# EAGLE schematic powersupply_example (EAGLE 7.4.0)
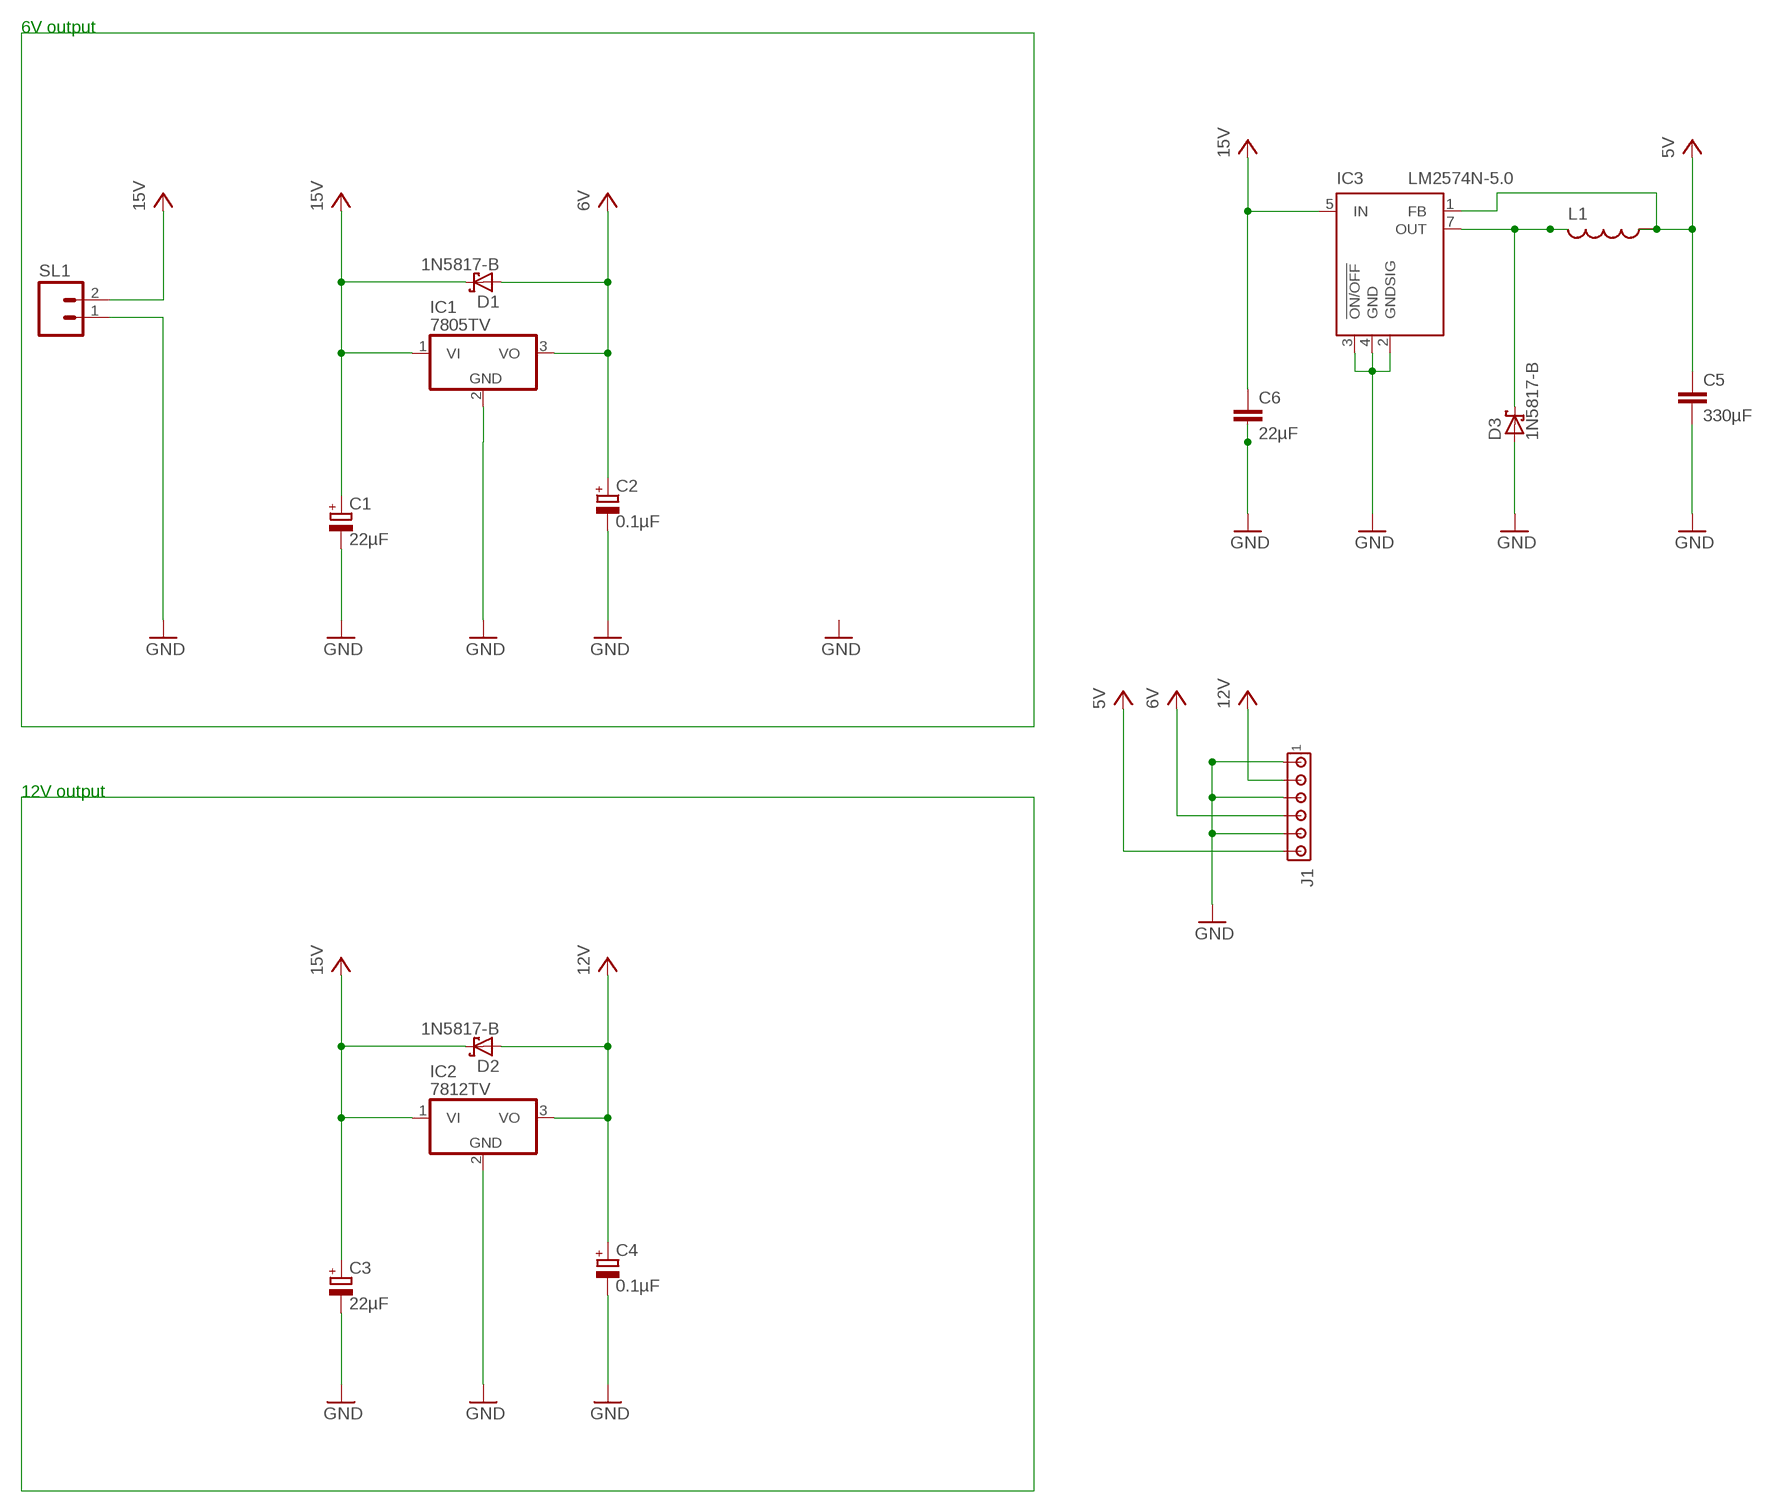
[diagram p0: schematic, sheet 1]

## Parts
C1  22µF  CPOL-EUE2.5-5  [E2,5-5]
C2  0.1µF  CPOL-EUE2.5-5  [E2,5-5]
C3  22µF  CPOL-EUE2.5-5  [E2,5-5]
C4  0.1µF  CPOL-EUE2.5-5  [E2,5-5]
C5  330µF  C-EU025-040X050  [C025-040X050]
C6  22µF  C-EU025-040X050  [C025-040X050]
D1  1N5817-B  [DO41-7.6]
D2  1N5817-B  [DO41-7.6]
D3  1N5817-B  [DO41-7.6]
IC1  7805TV  [TO220V]
IC2  7812TV  [TO220V]
IC3  LM2574N-5.0  [DIL08]
J1  MTA06-100  [10X06MTA]
L1  L-US0204/7  [0204/7]
SL1  M02  [02P]

## Nets
5V: C5.1 IC3.1(FB) J1.6 L1.1
6V: C2.+ D1.A IC1.3(VO) J1.4
12V: C4.+ D2.A IC2.3(VO) J1.2
15V: C1.+ C3.+ C6.1 D1.C D2.C IC1.1(VI) IC2.1(VI) IC3.5(IN) SL1.2
GND: C1.- C2.- C3.- C4.- C5.2 C6.2 D3.A IC1.2(GND) IC2.2(GND) IC3.2(GNDSIG) IC3.3(!ON/OFF) IC3.4(GND) J1.1 J1.3 J1.5 SL1.1
N$4: D3.C IC3.7(OUT) L1.2

## Notes on the sheet
- 6V output
- 12V output

## Library data of the parts
C1-C4 = rcl:CPOL-EU: POLARIZED CAPACITOR, European symbol
C5 C6 = rcl:C-EU: CAPACITOR, European symbol
D1-D3 = diode:1N581*: 1.0A SCHOTTKY BARRIER RECTIFIER Source: http://www.diodes.com/datasheets/ds23001.pdf
IC1 IC2 = linear:78*: Positive VOLTAGE REGULATOR Source: http://cache.national.com/ds/LM/LM78L05.pdf http://www.fairchildsemi.com/ds/LM/LM7805.pdf
IC3 = linear:LM2574?-*: SIMPLE SWITCHER 0.5A Step-Down Voltage Regulator Source: http://cache.national.com/ds/LM/LM2574.pdf
J1 = con-amp:MTA06-100: AMP connector Connection corrected 2014-09-19
L1 = resistor:L-US: INDUCTOR, American symbol
SL1 = con-amp-quick:M02: AMP QUICK CONNECTOR; OC_FARNELL: unknown; OC_NEWARK: unknown

## Net classes
0 default: width 0.61 mm, clearance 0.254 mm
1 ground: width 0.61 mm, clearance 0.254 mm